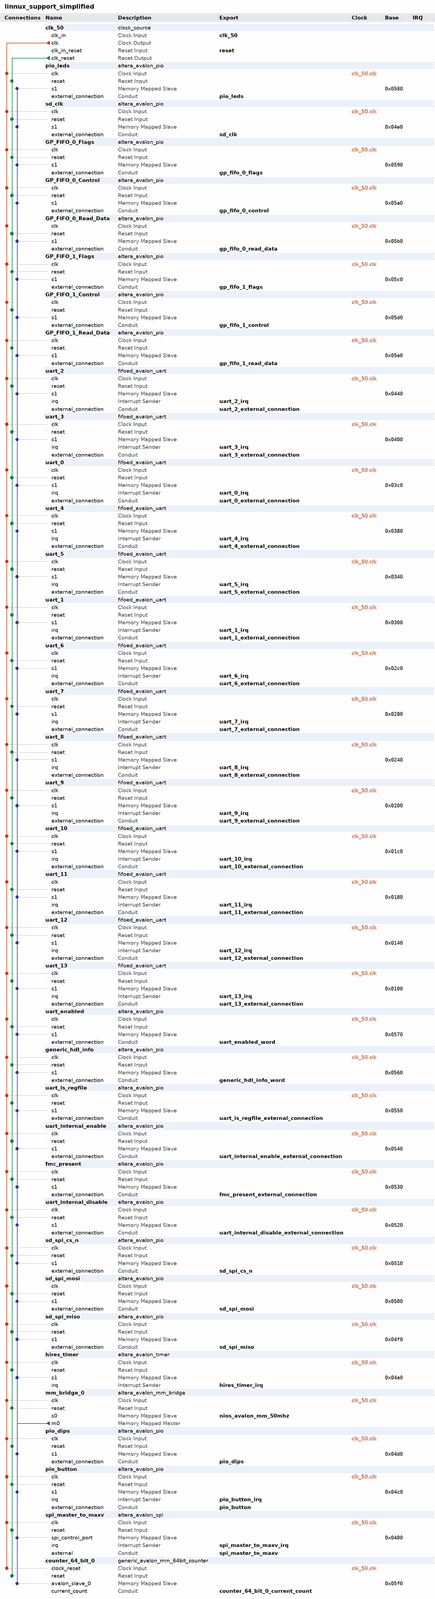
[diagram p0: system contents, whole]
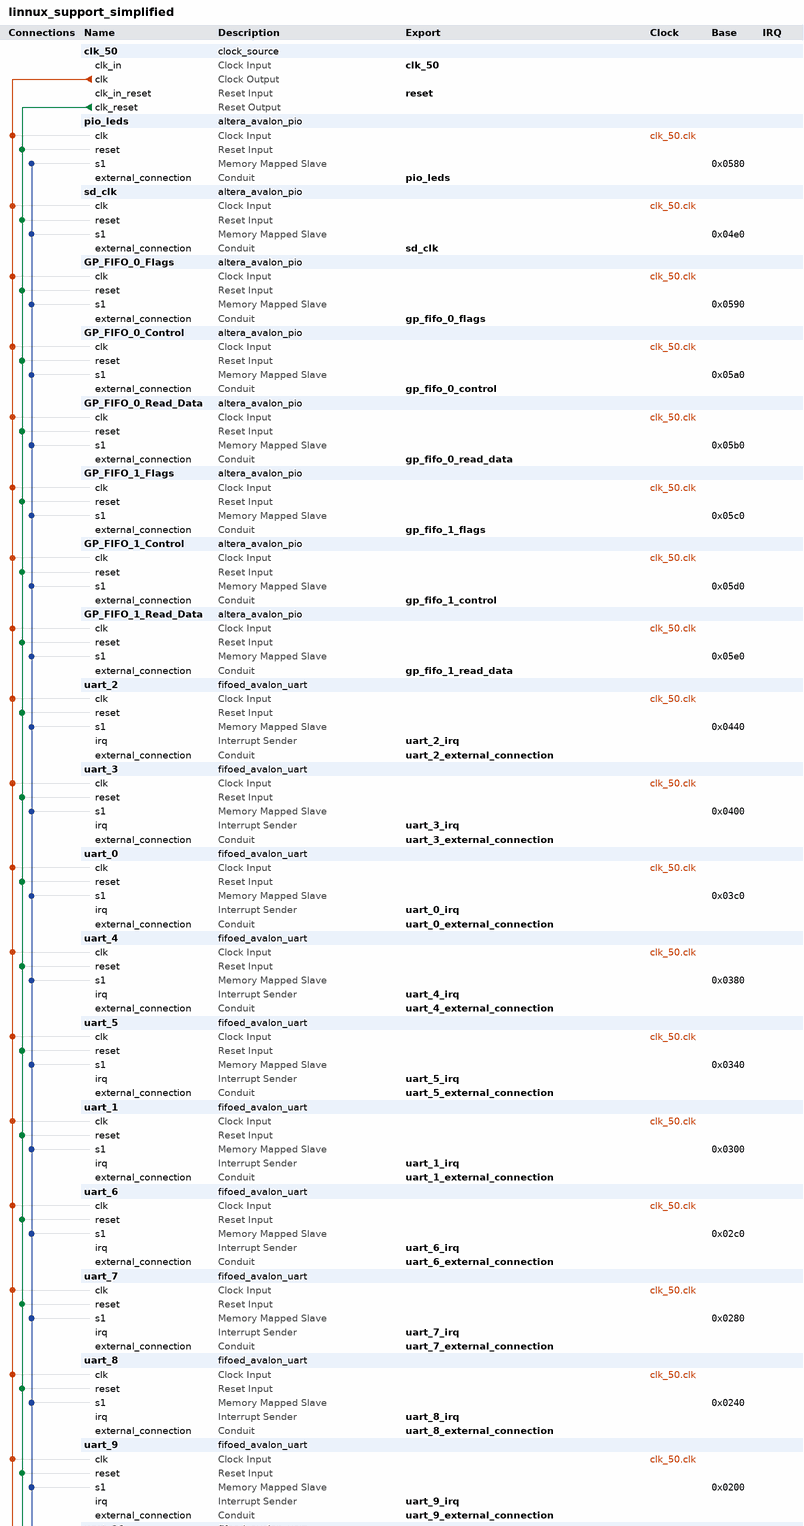
[diagram p1: system contents, upper part]
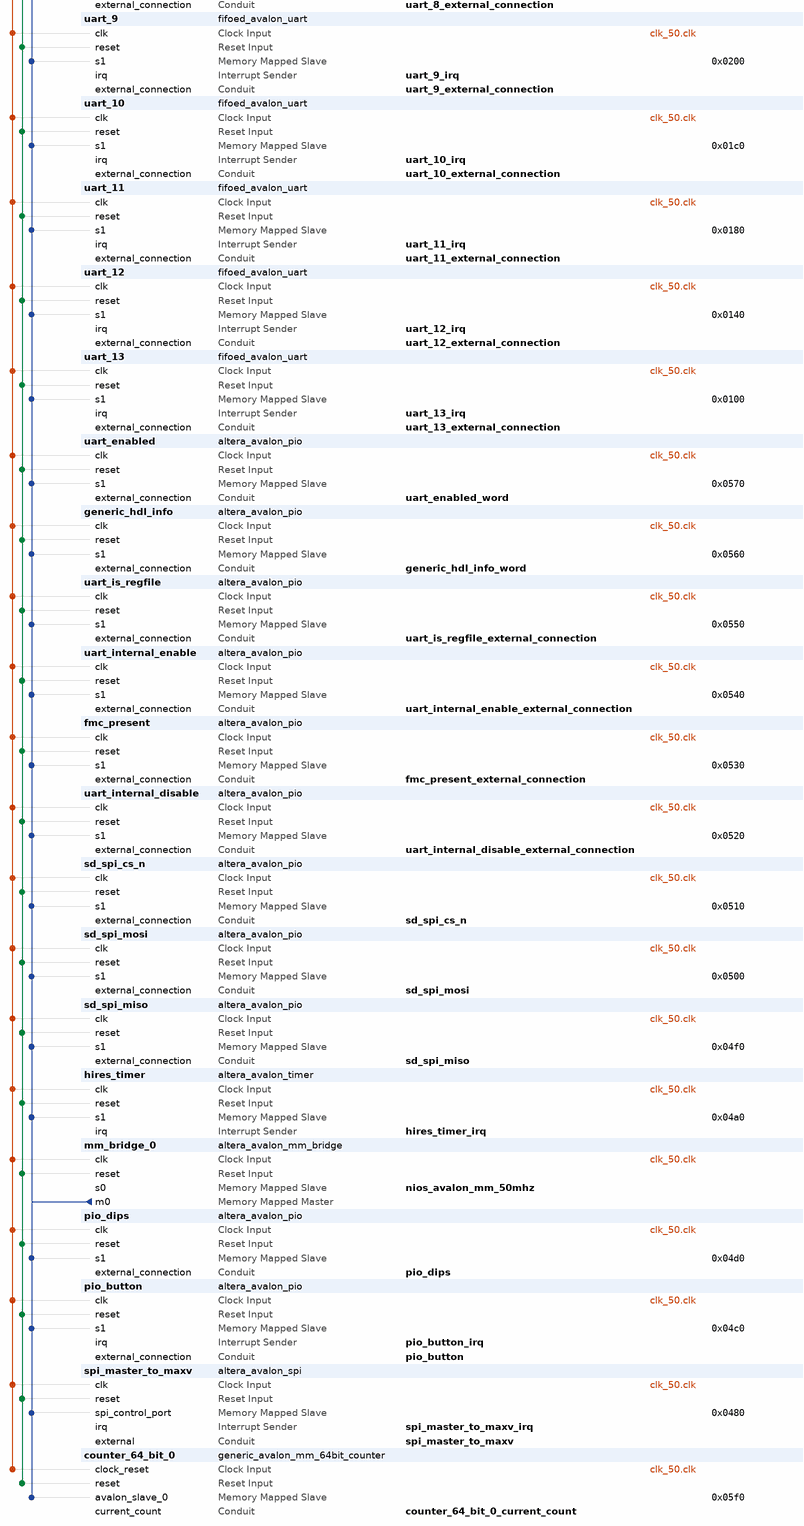
[diagram p2: system contents, lower part]
# Platform Designer (Qsys) system linnux_support_simplified, Stratix IV EP4SGX530KH40C2
# Parameters at their usual value, and those the tool derives, are not listed.
package require -exact qsys 14.1
create_system linnux_support_simplified
set_project_property DEVICE_FAMILY {Stratix IV}
set_project_property DEVICE EP4SGX530KH40C2

add_instance clk_50 clock_source 14.1
set_instance_parameter_value clk_50 clockFrequency 50000000

add_instance pio_leds altera_avalon_pio 14.1
set_instance_parameter_value pio_leds direction Output
set_instance_parameter_value pio_leds width 9

add_instance sd_clk altera_avalon_pio 14.1
set_instance_parameter_value sd_clk direction Output
set_instance_parameter_value sd_clk width 1

add_instance GP_FIFO_0_Flags altera_avalon_pio 14.1
set_instance_parameter_value GP_FIFO_0_Flags direction Input
set_instance_parameter_value GP_FIFO_0_Flags width 32

add_instance GP_FIFO_0_Control altera_avalon_pio 14.1
set_instance_parameter_value GP_FIFO_0_Control direction InOut
set_instance_parameter_value GP_FIFO_0_Control width 8

add_instance GP_FIFO_0_Read_Data altera_avalon_pio 14.1
set_instance_parameter_value GP_FIFO_0_Read_Data direction Input
set_instance_parameter_value GP_FIFO_0_Read_Data width 32

add_instance GP_FIFO_1_Flags altera_avalon_pio 14.1
set_instance_parameter_value GP_FIFO_1_Flags direction Input
set_instance_parameter_value GP_FIFO_1_Flags width 32

add_instance GP_FIFO_1_Control altera_avalon_pio 14.1
set_instance_parameter_value GP_FIFO_1_Control direction InOut
set_instance_parameter_value GP_FIFO_1_Control width 8

add_instance GP_FIFO_1_Read_Data altera_avalon_pio 14.1
set_instance_parameter_value GP_FIFO_1_Read_Data direction Input
set_instance_parameter_value GP_FIFO_1_Read_Data width 32

add_instance uart_2 fifoed_avalon_uart 13.1
set_instance_parameter_value uart_2 add_error_bits false
set_instance_parameter_value uart_2 baud 9600
set_instance_parameter_value uart_2 dataBits 8
set_instance_parameter_value uart_2 driver_pass_error_bits false
set_instance_parameter_value uart_2 export_handshake false
set_instance_parameter_value uart_2 fifo_export_used false
set_instance_parameter_value uart_2 fifo_size_rx 128
set_instance_parameter_value uart_2 fifo_size_tx 8
set_instance_parameter_value uart_2 fixedBaud true
set_instance_parameter_value uart_2 gap_value 4
set_instance_parameter_value uart_2 hw_cts false
set_instance_parameter_value uart_2 parity NONE
set_instance_parameter_value uart_2 rx_IRQ_Threshold 1
set_instance_parameter_value uart_2 rx_fifo_LE false
set_instance_parameter_value uart_2 simInteractiveInputEnable false
set_instance_parameter_value uart_2 simInteractiveOutputEnable false
set_instance_parameter_value uart_2 simTrueBaud false
set_instance_parameter_value uart_2 stopBits 1
set_instance_parameter_value uart_2 syncRegDepth 2
set_instance_parameter_value uart_2 timeout_value 20
set_instance_parameter_value uart_2 timestamp_width 8
set_instance_parameter_value uart_2 trans_pin false
set_instance_parameter_value uart_2 tx_IRQ_Threshold 1
set_instance_parameter_value uart_2 tx_fifo_LE false
set_instance_parameter_value uart_2 useCtsRts false
set_instance_parameter_value uart_2 useEopRegister false
set_instance_parameter_value uart_2 useRelativePathForSimFile false
set_instance_parameter_value uart_2 use_ext_timestamp false
set_instance_parameter_value uart_2 use_gap_detection false
set_instance_parameter_value uart_2 use_rx_fifo true
set_instance_parameter_value uart_2 use_status_bit_clear false
set_instance_parameter_value uart_2 use_timestamp false
set_instance_parameter_value uart_2 use_timout true
set_instance_parameter_value uart_2 use_tx_fifo false

add_instance uart_3 fifoed_avalon_uart 13.1
set_instance_parameter_value uart_3 add_error_bits false
set_instance_parameter_value uart_3 baud 9600
set_instance_parameter_value uart_3 dataBits 8
set_instance_parameter_value uart_3 driver_pass_error_bits false
set_instance_parameter_value uart_3 export_handshake false
set_instance_parameter_value uart_3 fifo_export_used false
set_instance_parameter_value uart_3 fifo_size_rx 128
set_instance_parameter_value uart_3 fifo_size_tx 8
set_instance_parameter_value uart_3 fixedBaud true
set_instance_parameter_value uart_3 gap_value 4
set_instance_parameter_value uart_3 hw_cts false
set_instance_parameter_value uart_3 parity NONE
set_instance_parameter_value uart_3 rx_IRQ_Threshold 1
set_instance_parameter_value uart_3 rx_fifo_LE false
set_instance_parameter_value uart_3 simInteractiveInputEnable false
set_instance_parameter_value uart_3 simInteractiveOutputEnable false
set_instance_parameter_value uart_3 simTrueBaud false
set_instance_parameter_value uart_3 stopBits 1
set_instance_parameter_value uart_3 syncRegDepth 2
set_instance_parameter_value uart_3 timeout_value 20
set_instance_parameter_value uart_3 timestamp_width 8
set_instance_parameter_value uart_3 trans_pin false
set_instance_parameter_value uart_3 tx_IRQ_Threshold 1
set_instance_parameter_value uart_3 tx_fifo_LE false
set_instance_parameter_value uart_3 useCtsRts false
set_instance_parameter_value uart_3 useEopRegister false
set_instance_parameter_value uart_3 useRelativePathForSimFile false
set_instance_parameter_value uart_3 use_ext_timestamp false
set_instance_parameter_value uart_3 use_gap_detection false
set_instance_parameter_value uart_3 use_rx_fifo true
set_instance_parameter_value uart_3 use_status_bit_clear false
set_instance_parameter_value uart_3 use_timestamp false
set_instance_parameter_value uart_3 use_timout true
set_instance_parameter_value uart_3 use_tx_fifo false

add_instance uart_0 fifoed_avalon_uart 13.1
set_instance_parameter_value uart_0 add_error_bits false
set_instance_parameter_value uart_0 baud 2000000
set_instance_parameter_value uart_0 dataBits 8
set_instance_parameter_value uart_0 driver_pass_error_bits false
set_instance_parameter_value uart_0 export_handshake false
set_instance_parameter_value uart_0 fifo_export_used false
set_instance_parameter_value uart_0 fifo_size_rx 128
set_instance_parameter_value uart_0 fifo_size_tx 128
set_instance_parameter_value uart_0 fixedBaud false
set_instance_parameter_value uart_0 gap_value 4
set_instance_parameter_value uart_0 hw_cts false
set_instance_parameter_value uart_0 parity NONE
set_instance_parameter_value uart_0 rx_IRQ_Threshold 1
set_instance_parameter_value uart_0 rx_fifo_LE false
set_instance_parameter_value uart_0 simInteractiveInputEnable false
set_instance_parameter_value uart_0 simInteractiveOutputEnable false
set_instance_parameter_value uart_0 simTrueBaud false
set_instance_parameter_value uart_0 stopBits 1
set_instance_parameter_value uart_0 syncRegDepth 2
set_instance_parameter_value uart_0 timeout_value 20
set_instance_parameter_value uart_0 timestamp_width 8
set_instance_parameter_value uart_0 trans_pin false
set_instance_parameter_value uart_0 tx_IRQ_Threshold 1
set_instance_parameter_value uart_0 tx_fifo_LE false
set_instance_parameter_value uart_0 useCtsRts false
set_instance_parameter_value uart_0 useEopRegister false
set_instance_parameter_value uart_0 useRelativePathForSimFile false
set_instance_parameter_value uart_0 use_ext_timestamp false
set_instance_parameter_value uart_0 use_gap_detection false
set_instance_parameter_value uart_0 use_rx_fifo true
set_instance_parameter_value uart_0 use_status_bit_clear false
set_instance_parameter_value uart_0 use_timestamp false
set_instance_parameter_value uart_0 use_timout true
set_instance_parameter_value uart_0 use_tx_fifo false

add_instance uart_4 fifoed_avalon_uart 13.1
set_instance_parameter_value uart_4 add_error_bits false
set_instance_parameter_value uart_4 baud 9600
set_instance_parameter_value uart_4 dataBits 8
set_instance_parameter_value uart_4 driver_pass_error_bits false
set_instance_parameter_value uart_4 export_handshake false
set_instance_parameter_value uart_4 fifo_export_used false
set_instance_parameter_value uart_4 fifo_size_rx 128
set_instance_parameter_value uart_4 fifo_size_tx 128
set_instance_parameter_value uart_4 fixedBaud true
set_instance_parameter_value uart_4 gap_value 4
set_instance_parameter_value uart_4 hw_cts false
set_instance_parameter_value uart_4 parity NONE
set_instance_parameter_value uart_4 rx_IRQ_Threshold 1
set_instance_parameter_value uart_4 rx_fifo_LE false
set_instance_parameter_value uart_4 simInteractiveInputEnable false
set_instance_parameter_value uart_4 simInteractiveOutputEnable false
set_instance_parameter_value uart_4 simTrueBaud false
set_instance_parameter_value uart_4 stopBits 1
set_instance_parameter_value uart_4 syncRegDepth 2
set_instance_parameter_value uart_4 timeout_value 20
set_instance_parameter_value uart_4 timestamp_width 8
set_instance_parameter_value uart_4 trans_pin false
set_instance_parameter_value uart_4 tx_IRQ_Threshold 1
set_instance_parameter_value uart_4 tx_fifo_LE false
set_instance_parameter_value uart_4 useCtsRts false
set_instance_parameter_value uart_4 useEopRegister false
set_instance_parameter_value uart_4 useRelativePathForSimFile false
set_instance_parameter_value uart_4 use_ext_timestamp false
set_instance_parameter_value uart_4 use_gap_detection false
set_instance_parameter_value uart_4 use_rx_fifo true
set_instance_parameter_value uart_4 use_status_bit_clear false
set_instance_parameter_value uart_4 use_timestamp false
set_instance_parameter_value uart_4 use_timout true
set_instance_parameter_value uart_4 use_tx_fifo false

add_instance uart_5 fifoed_avalon_uart 13.1
set_instance_parameter_value uart_5 add_error_bits false
set_instance_parameter_value uart_5 baud 2000000
set_instance_parameter_value uart_5 dataBits 8
set_instance_parameter_value uart_5 driver_pass_error_bits false
set_instance_parameter_value uart_5 export_handshake false
set_instance_parameter_value uart_5 fifo_export_used false
set_instance_parameter_value uart_5 fifo_size_rx 128
set_instance_parameter_value uart_5 fifo_size_tx 8
set_instance_parameter_value uart_5 fixedBaud true
set_instance_parameter_value uart_5 gap_value 4
set_instance_parameter_value uart_5 hw_cts false
set_instance_parameter_value uart_5 parity NONE
set_instance_parameter_value uart_5 rx_IRQ_Threshold 1
set_instance_parameter_value uart_5 rx_fifo_LE false
set_instance_parameter_value uart_5 simInteractiveInputEnable false
set_instance_parameter_value uart_5 simInteractiveOutputEnable false
set_instance_parameter_value uart_5 simTrueBaud false
set_instance_parameter_value uart_5 stopBits 1
set_instance_parameter_value uart_5 syncRegDepth 2
set_instance_parameter_value uart_5 timeout_value 20
set_instance_parameter_value uart_5 timestamp_width 8
set_instance_parameter_value uart_5 trans_pin false
set_instance_parameter_value uart_5 tx_IRQ_Threshold 1
set_instance_parameter_value uart_5 tx_fifo_LE false
set_instance_parameter_value uart_5 useCtsRts false
set_instance_parameter_value uart_5 useEopRegister false
set_instance_parameter_value uart_5 useRelativePathForSimFile false
set_instance_parameter_value uart_5 use_ext_timestamp false
set_instance_parameter_value uart_5 use_gap_detection false
set_instance_parameter_value uart_5 use_rx_fifo true
set_instance_parameter_value uart_5 use_status_bit_clear false
set_instance_parameter_value uart_5 use_timestamp false
set_instance_parameter_value uart_5 use_timout true
set_instance_parameter_value uart_5 use_tx_fifo false

add_instance uart_1 fifoed_avalon_uart 13.1
set_instance_parameter_value uart_1 add_error_bits false
set_instance_parameter_value uart_1 baud 9600
set_instance_parameter_value uart_1 dataBits 8
set_instance_parameter_value uart_1 driver_pass_error_bits false
set_instance_parameter_value uart_1 export_handshake false
set_instance_parameter_value uart_1 fifo_export_used false
set_instance_parameter_value uart_1 fifo_size_rx 128
set_instance_parameter_value uart_1 fifo_size_tx 8
set_instance_parameter_value uart_1 fixedBaud true
set_instance_parameter_value uart_1 gap_value 4
set_instance_parameter_value uart_1 hw_cts false
set_instance_parameter_value uart_1 parity NONE
set_instance_parameter_value uart_1 rx_IRQ_Threshold 1
set_instance_parameter_value uart_1 rx_fifo_LE false
set_instance_parameter_value uart_1 simInteractiveInputEnable false
set_instance_parameter_value uart_1 simInteractiveOutputEnable false
set_instance_parameter_value uart_1 simTrueBaud false
set_instance_parameter_value uart_1 stopBits 1
set_instance_parameter_value uart_1 syncRegDepth 2
set_instance_parameter_value uart_1 timeout_value 20
set_instance_parameter_value uart_1 timestamp_width 8
set_instance_parameter_value uart_1 trans_pin false
set_instance_parameter_value uart_1 tx_IRQ_Threshold 1
set_instance_parameter_value uart_1 tx_fifo_LE false
set_instance_parameter_value uart_1 useCtsRts false
set_instance_parameter_value uart_1 useEopRegister false
set_instance_parameter_value uart_1 useRelativePathForSimFile false
set_instance_parameter_value uart_1 use_ext_timestamp false
set_instance_parameter_value uart_1 use_gap_detection false
set_instance_parameter_value uart_1 use_rx_fifo true
set_instance_parameter_value uart_1 use_status_bit_clear false
set_instance_parameter_value uart_1 use_timestamp false
set_instance_parameter_value uart_1 use_timout true
set_instance_parameter_value uart_1 use_tx_fifo false

add_instance uart_6 fifoed_avalon_uart 13.1
set_instance_parameter_value uart_6 add_error_bits false
set_instance_parameter_value uart_6 baud 2000000
set_instance_parameter_value uart_6 dataBits 8
set_instance_parameter_value uart_6 driver_pass_error_bits false
set_instance_parameter_value uart_6 export_handshake false
set_instance_parameter_value uart_6 fifo_export_used false
set_instance_parameter_value uart_6 fifo_size_rx 128
set_instance_parameter_value uart_6 fifo_size_tx 8
set_instance_parameter_value uart_6 fixedBaud true
set_instance_parameter_value uart_6 gap_value 4
set_instance_parameter_value uart_6 hw_cts false
set_instance_parameter_value uart_6 parity NONE
set_instance_parameter_value uart_6 rx_IRQ_Threshold 1
set_instance_parameter_value uart_6 rx_fifo_LE false
set_instance_parameter_value uart_6 simInteractiveInputEnable false
set_instance_parameter_value uart_6 simInteractiveOutputEnable false
set_instance_parameter_value uart_6 simTrueBaud false
set_instance_parameter_value uart_6 stopBits 1
set_instance_parameter_value uart_6 syncRegDepth 2
set_instance_parameter_value uart_6 timeout_value 20
set_instance_parameter_value uart_6 timestamp_width 8
set_instance_parameter_value uart_6 trans_pin false
set_instance_parameter_value uart_6 tx_IRQ_Threshold 1
set_instance_parameter_value uart_6 tx_fifo_LE false
set_instance_parameter_value uart_6 useCtsRts false
set_instance_parameter_value uart_6 useEopRegister false
set_instance_parameter_value uart_6 useRelativePathForSimFile false
set_instance_parameter_value uart_6 use_ext_timestamp false
set_instance_parameter_value uart_6 use_gap_detection false
set_instance_parameter_value uart_6 use_rx_fifo true
set_instance_parameter_value uart_6 use_status_bit_clear false
set_instance_parameter_value uart_6 use_timestamp false
set_instance_parameter_value uart_6 use_timout true
set_instance_parameter_value uart_6 use_tx_fifo false

add_instance uart_7 fifoed_avalon_uart 13.1
set_instance_parameter_value uart_7 add_error_bits false
set_instance_parameter_value uart_7 baud 2000000
set_instance_parameter_value uart_7 dataBits 8
set_instance_parameter_value uart_7 driver_pass_error_bits false
set_instance_parameter_value uart_7 export_handshake false
set_instance_parameter_value uart_7 fifo_export_used false
set_instance_parameter_value uart_7 fifo_size_rx 128
set_instance_parameter_value uart_7 fifo_size_tx 8
set_instance_parameter_value uart_7 fixedBaud true
set_instance_parameter_value uart_7 gap_value 4
set_instance_parameter_value uart_7 hw_cts false
set_instance_parameter_value uart_7 parity NONE
set_instance_parameter_value uart_7 rx_IRQ_Threshold 1
set_instance_parameter_value uart_7 rx_fifo_LE false
set_instance_parameter_value uart_7 simInteractiveInputEnable false
set_instance_parameter_value uart_7 simInteractiveOutputEnable false
set_instance_parameter_value uart_7 simTrueBaud false
set_instance_parameter_value uart_7 stopBits 1
set_instance_parameter_value uart_7 syncRegDepth 2
set_instance_parameter_value uart_7 timeout_value 20
set_instance_parameter_value uart_7 timestamp_width 8
set_instance_parameter_value uart_7 trans_pin false
set_instance_parameter_value uart_7 tx_IRQ_Threshold 1
set_instance_parameter_value uart_7 tx_fifo_LE false
set_instance_parameter_value uart_7 useCtsRts false
set_instance_parameter_value uart_7 useEopRegister false
set_instance_parameter_value uart_7 useRelativePathForSimFile false
set_instance_parameter_value uart_7 use_ext_timestamp false
set_instance_parameter_value uart_7 use_gap_detection false
set_instance_parameter_value uart_7 use_rx_fifo true
set_instance_parameter_value uart_7 use_status_bit_clear false
set_instance_parameter_value uart_7 use_timestamp false
set_instance_parameter_value uart_7 use_timout true
set_instance_parameter_value uart_7 use_tx_fifo false

add_instance uart_8 fifoed_avalon_uart 13.1
set_instance_parameter_value uart_8 add_error_bits false
set_instance_parameter_value uart_8 baud 2000000
set_instance_parameter_value uart_8 dataBits 8
set_instance_parameter_value uart_8 driver_pass_error_bits false
set_instance_parameter_value uart_8 export_handshake false
set_instance_parameter_value uart_8 fifo_export_used false
set_instance_parameter_value uart_8 fifo_size_rx 128
set_instance_parameter_value uart_8 fifo_size_tx 8
set_instance_parameter_value uart_8 fixedBaud true
set_instance_parameter_value uart_8 gap_value 4
set_instance_parameter_value uart_8 hw_cts false
set_instance_parameter_value uart_8 parity NONE
set_instance_parameter_value uart_8 rx_IRQ_Threshold 1
set_instance_parameter_value uart_8 rx_fifo_LE false
set_instance_parameter_value uart_8 simInteractiveInputEnable false
set_instance_parameter_value uart_8 simInteractiveOutputEnable false
set_instance_parameter_value uart_8 simTrueBaud false
set_instance_parameter_value uart_8 stopBits 1
set_instance_parameter_value uart_8 syncRegDepth 2
set_instance_parameter_value uart_8 timeout_value 20
set_instance_parameter_value uart_8 timestamp_width 8
set_instance_parameter_value uart_8 trans_pin false
set_instance_parameter_value uart_8 tx_IRQ_Threshold 1
set_instance_parameter_value uart_8 tx_fifo_LE false
set_instance_parameter_value uart_8 useCtsRts false
set_instance_parameter_value uart_8 useEopRegister false
set_instance_parameter_value uart_8 useRelativePathForSimFile false
set_instance_parameter_value uart_8 use_ext_timestamp false
set_instance_parameter_value uart_8 use_gap_detection false
set_instance_parameter_value uart_8 use_rx_fifo true
set_instance_parameter_value uart_8 use_status_bit_clear false
set_instance_parameter_value uart_8 use_timestamp false
set_instance_parameter_value uart_8 use_timout true
set_instance_parameter_value uart_8 use_tx_fifo false

add_instance uart_9 fifoed_avalon_uart 13.1
set_instance_parameter_value uart_9 add_error_bits false
set_instance_parameter_value uart_9 baud 2000000
set_instance_parameter_value uart_9 dataBits 8
set_instance_parameter_value uart_9 driver_pass_error_bits false
set_instance_parameter_value uart_9 export_handshake false
set_instance_parameter_value uart_9 fifo_export_used false
set_instance_parameter_value uart_9 fifo_size_rx 128
set_instance_parameter_value uart_9 fifo_size_tx 8
set_instance_parameter_value uart_9 fixedBaud true
set_instance_parameter_value uart_9 gap_value 4
set_instance_parameter_value uart_9 hw_cts false
set_instance_parameter_value uart_9 parity NONE
set_instance_parameter_value uart_9 rx_IRQ_Threshold 1
set_instance_parameter_value uart_9 rx_fifo_LE false
set_instance_parameter_value uart_9 simInteractiveInputEnable false
set_instance_parameter_value uart_9 simInteractiveOutputEnable false
set_instance_parameter_value uart_9 simTrueBaud false
set_instance_parameter_value uart_9 stopBits 1
set_instance_parameter_value uart_9 syncRegDepth 2
set_instance_parameter_value uart_9 timeout_value 20
set_instance_parameter_value uart_9 timestamp_width 8
set_instance_parameter_value uart_9 trans_pin false
set_instance_parameter_value uart_9 tx_IRQ_Threshold 1
set_instance_parameter_value uart_9 tx_fifo_LE false
set_instance_parameter_value uart_9 useCtsRts false
set_instance_parameter_value uart_9 useEopRegister false
set_instance_parameter_value uart_9 useRelativePathForSimFile false
set_instance_parameter_value uart_9 use_ext_timestamp false
set_instance_parameter_value uart_9 use_gap_detection false
set_instance_parameter_value uart_9 use_rx_fifo true
set_instance_parameter_value uart_9 use_status_bit_clear false
set_instance_parameter_value uart_9 use_timestamp false
set_instance_parameter_value uart_9 use_timout true
set_instance_parameter_value uart_9 use_tx_fifo false

add_instance uart_10 fifoed_avalon_uart 13.1
set_instance_parameter_value uart_10 add_error_bits false
set_instance_parameter_value uart_10 baud 2000000
set_instance_parameter_value uart_10 dataBits 8
set_instance_parameter_value uart_10 driver_pass_error_bits false
set_instance_parameter_value uart_10 export_handshake false
set_instance_parameter_value uart_10 fifo_export_used false
set_instance_parameter_value uart_10 fifo_size_rx 128
set_instance_parameter_value uart_10 fifo_size_tx 8
set_instance_parameter_value uart_10 fixedBaud true
set_instance_parameter_value uart_10 gap_value 4
set_instance_parameter_value uart_10 hw_cts false
set_instance_parameter_value uart_10 parity NONE
set_instance_parameter_value uart_10 rx_IRQ_Threshold 1
set_instance_parameter_value uart_10 rx_fifo_LE false
set_instance_parameter_value uart_10 simInteractiveInputEnable false
set_instance_parameter_value uart_10 simInteractiveOutputEnable false
set_instance_parameter_value uart_10 simTrueBaud false
set_instance_parameter_value uart_10 stopBits 1
set_instance_parameter_value uart_10 syncRegDepth 2
set_instance_parameter_value uart_10 timeout_value 20
set_instance_parameter_value uart_10 timestamp_width 8
set_instance_parameter_value uart_10 trans_pin false
set_instance_parameter_value uart_10 tx_IRQ_Threshold 1
set_instance_parameter_value uart_10 tx_fifo_LE false
set_instance_parameter_value uart_10 useCtsRts false
set_instance_parameter_value uart_10 useEopRegister false
set_instance_parameter_value uart_10 useRelativePathForSimFile false
set_instance_parameter_value uart_10 use_ext_timestamp false
set_instance_parameter_value uart_10 use_gap_detection false
set_instance_parameter_value uart_10 use_rx_fifo true
set_instance_parameter_value uart_10 use_status_bit_clear false
set_instance_parameter_value uart_10 use_timestamp false
set_instance_parameter_value uart_10 use_timout true
set_instance_parameter_value uart_10 use_tx_fifo false

add_instance uart_11 fifoed_avalon_uart 13.1
set_instance_parameter_value uart_11 add_error_bits false
set_instance_parameter_value uart_11 baud 2000000
set_instance_parameter_value uart_11 dataBits 8
set_instance_parameter_value uart_11 driver_pass_error_bits false
set_instance_parameter_value uart_11 export_handshake false
set_instance_parameter_value uart_11 fifo_export_used false
set_instance_parameter_value uart_11 fifo_size_rx 128
set_instance_parameter_value uart_11 fifo_size_tx 8
set_instance_parameter_value uart_11 fixedBaud true
set_instance_parameter_value uart_11 gap_value 4
set_instance_parameter_value uart_11 hw_cts false
set_instance_parameter_value uart_11 parity NONE
set_instance_parameter_value uart_11 rx_IRQ_Threshold 1
set_instance_parameter_value uart_11 rx_fifo_LE false
set_instance_parameter_value uart_11 simInteractiveInputEnable false
set_instance_parameter_value uart_11 simInteractiveOutputEnable false
set_instance_parameter_value uart_11 simTrueBaud false
set_instance_parameter_value uart_11 stopBits 1
set_instance_parameter_value uart_11 syncRegDepth 2
set_instance_parameter_value uart_11 timeout_value 20
set_instance_parameter_value uart_11 timestamp_width 8
set_instance_parameter_value uart_11 trans_pin false
set_instance_parameter_value uart_11 tx_IRQ_Threshold 1
set_instance_parameter_value uart_11 tx_fifo_LE false
set_instance_parameter_value uart_11 useCtsRts false
set_instance_parameter_value uart_11 useEopRegister false
set_instance_parameter_value uart_11 useRelativePathForSimFile false
set_instance_parameter_value uart_11 use_ext_timestamp false
set_instance_parameter_value uart_11 use_gap_detection false
set_instance_parameter_value uart_11 use_rx_fifo true
set_instance_parameter_value uart_11 use_status_bit_clear false
set_instance_parameter_value uart_11 use_timestamp false
set_instance_parameter_value uart_11 use_timout true
set_instance_parameter_value uart_11 use_tx_fifo false

add_instance uart_12 fifoed_avalon_uart 13.1
set_instance_parameter_value uart_12 add_error_bits false
set_instance_parameter_value uart_12 baud 2000000
set_instance_parameter_value uart_12 dataBits 8
set_instance_parameter_value uart_12 driver_pass_error_bits false
set_instance_parameter_value uart_12 export_handshake false
set_instance_parameter_value uart_12 fifo_export_used false
set_instance_parameter_value uart_12 fifo_size_rx 128
set_instance_parameter_value uart_12 fifo_size_tx 8
set_instance_parameter_value uart_12 fixedBaud true
set_instance_parameter_value uart_12 gap_value 4
set_instance_parameter_value uart_12 hw_cts false
set_instance_parameter_value uart_12 parity NONE
set_instance_parameter_value uart_12 rx_IRQ_Threshold 1
set_instance_parameter_value uart_12 rx_fifo_LE false
set_instance_parameter_value uart_12 simInteractiveInputEnable false
set_instance_parameter_value uart_12 simInteractiveOutputEnable false
set_instance_parameter_value uart_12 simTrueBaud false
set_instance_parameter_value uart_12 stopBits 1
set_instance_parameter_value uart_12 syncRegDepth 2
set_instance_parameter_value uart_12 timeout_value 20
set_instance_parameter_value uart_12 timestamp_width 8
set_instance_parameter_value uart_12 trans_pin false
set_instance_parameter_value uart_12 tx_IRQ_Threshold 1
set_instance_parameter_value uart_12 tx_fifo_LE false
set_instance_parameter_value uart_12 useCtsRts false
set_instance_parameter_value uart_12 useEopRegister false
set_instance_parameter_value uart_12 useRelativePathForSimFile false
set_instance_parameter_value uart_12 use_ext_timestamp false
set_instance_parameter_value uart_12 use_gap_detection false
set_instance_parameter_value uart_12 use_rx_fifo true
set_instance_parameter_value uart_12 use_status_bit_clear false
set_instance_parameter_value uart_12 use_timestamp false
set_instance_parameter_value uart_12 use_timout true
set_instance_parameter_value uart_12 use_tx_fifo false

add_instance uart_13 fifoed_avalon_uart 13.1
set_instance_parameter_value uart_13 add_error_bits false
set_instance_parameter_value uart_13 baud 2000000
set_instance_parameter_value uart_13 dataBits 8
set_instance_parameter_value uart_13 driver_pass_error_bits false
set_instance_parameter_value uart_13 export_handshake false
set_instance_parameter_value uart_13 fifo_export_used false
set_instance_parameter_value uart_13 fifo_size_rx 128
set_instance_parameter_value uart_13 fifo_size_tx 8
set_instance_parameter_value uart_13 fixedBaud true
set_instance_parameter_value uart_13 gap_value 4
set_instance_parameter_value uart_13 hw_cts false
set_instance_parameter_value uart_13 parity NONE
set_instance_parameter_value uart_13 rx_IRQ_Threshold 1
set_instance_parameter_value uart_13 rx_fifo_LE false
set_instance_parameter_value uart_13 simInteractiveInputEnable false
set_instance_parameter_value uart_13 simInteractiveOutputEnable false
set_instance_parameter_value uart_13 simTrueBaud false
set_instance_parameter_value uart_13 stopBits 1
set_instance_parameter_value uart_13 syncRegDepth 2
set_instance_parameter_value uart_13 timeout_value 20
set_instance_parameter_value uart_13 timestamp_width 8
set_instance_parameter_value uart_13 trans_pin false
set_instance_parameter_value uart_13 tx_IRQ_Threshold 1
set_instance_parameter_value uart_13 tx_fifo_LE false
set_instance_parameter_value uart_13 useCtsRts false
set_instance_parameter_value uart_13 useEopRegister false
set_instance_parameter_value uart_13 useRelativePathForSimFile false
set_instance_parameter_value uart_13 use_ext_timestamp false
set_instance_parameter_value uart_13 use_gap_detection false
set_instance_parameter_value uart_13 use_rx_fifo true
set_instance_parameter_value uart_13 use_status_bit_clear false
set_instance_parameter_value uart_13 use_timestamp false
set_instance_parameter_value uart_13 use_timout true
set_instance_parameter_value uart_13 use_tx_fifo false

add_instance uart_enabled altera_avalon_pio 14.1
set_instance_parameter_value uart_enabled direction Input
set_instance_parameter_value uart_enabled width 32

add_instance generic_hdl_info altera_avalon_pio 14.1
set_instance_parameter_value generic_hdl_info direction Input
set_instance_parameter_value generic_hdl_info width 32

add_instance uart_is_regfile altera_avalon_pio 14.1
set_instance_parameter_value uart_is_regfile direction Input
set_instance_parameter_value uart_is_regfile width 32

add_instance uart_internal_enable altera_avalon_pio 14.1
set_instance_parameter_value uart_internal_enable direction Output
set_instance_parameter_value uart_internal_enable width 32

add_instance fmc_present altera_avalon_pio 14.1
set_instance_parameter_value fmc_present direction Input
set_instance_parameter_value fmc_present width 16

add_instance uart_internal_disable altera_avalon_pio 14.1
set_instance_parameter_value uart_internal_disable direction Output
set_instance_parameter_value uart_internal_disable width 32

add_instance sd_spi_cs_n altera_avalon_pio 14.1
set_instance_parameter_value sd_spi_cs_n direction Output
set_instance_parameter_value sd_spi_cs_n resetValue 1
set_instance_parameter_value sd_spi_cs_n width 1

add_instance sd_spi_mosi altera_avalon_pio 14.1
set_instance_parameter_value sd_spi_mosi direction Output
set_instance_parameter_value sd_spi_mosi resetValue 1
set_instance_parameter_value sd_spi_mosi width 1

add_instance sd_spi_miso altera_avalon_pio 14.1
set_instance_parameter_value sd_spi_miso direction Input
set_instance_parameter_value sd_spi_miso width 1

add_instance hires_timer altera_avalon_timer 14.1
set_instance_parameter_value hires_timer period 1
set_instance_parameter_value hires_timer periodUnits MSEC

add_instance mm_bridge_0 altera_avalon_mm_bridge 14.1
set_instance_parameter_value mm_bridge_0 ADDRESS_UNITS SYMBOLS
set_instance_parameter_value mm_bridge_0 ADDRESS_WIDTH 27
set_instance_parameter_value mm_bridge_0 DATA_WIDTH 32
set_instance_parameter_value mm_bridge_0 MAX_PENDING_RESPONSES 4
set_instance_parameter_value mm_bridge_0 USE_AUTO_ADDRESS_WIDTH 0

add_instance pio_dips altera_avalon_pio 14.1
set_instance_parameter_value pio_dips direction Input
set_instance_parameter_value pio_dips width 8

add_instance pio_button altera_avalon_pio 14.1
set_instance_parameter_value pio_button captureEdge true
set_instance_parameter_value pio_button direction Input
set_instance_parameter_value pio_button generateIRQ true
set_instance_parameter_value pio_button irqType EDGE
set_instance_parameter_value pio_button width 8

add_instance spi_master_to_maxv altera_avalon_spi 14.1
set_instance_parameter_value spi_master_to_maxv clockPhase 1
set_instance_parameter_value spi_master_to_maxv clockPolarity 0
set_instance_parameter_value spi_master_to_maxv dataWidth 8
set_instance_parameter_value spi_master_to_maxv insertSync true
set_instance_parameter_value spi_master_to_maxv masterSPI true
set_instance_parameter_value spi_master_to_maxv numberOfSlaves 1
set_instance_parameter_value spi_master_to_maxv syncRegDepth 3
set_instance_parameter_value spi_master_to_maxv targetClockRate 32000

add_instance counter_64_bit_0 generic_avalon_mm_64bit_counter 2.0

# connections
add_connection clk_50.clk counter_64_bit_0.clock_reset clock
add_connection clk_50.clk fmc_present.clk clock
add_connection clk_50.clk generic_hdl_info.clk clock
add_connection clk_50.clk GP_FIFO_0_Control.clk clock
add_connection clk_50.clk GP_FIFO_0_Flags.clk clock
add_connection clk_50.clk GP_FIFO_0_Read_Data.clk clock
add_connection clk_50.clk GP_FIFO_1_Control.clk clock
add_connection clk_50.clk GP_FIFO_1_Flags.clk clock
add_connection clk_50.clk GP_FIFO_1_Read_Data.clk clock
add_connection clk_50.clk hires_timer.clk clock
add_connection clk_50.clk mm_bridge_0.clk clock
add_connection clk_50.clk pio_button.clk clock
add_connection clk_50.clk pio_dips.clk clock
add_connection clk_50.clk pio_leds.clk clock
add_connection clk_50.clk sd_clk.clk clock
add_connection clk_50.clk sd_spi_cs_n.clk clock
add_connection clk_50.clk sd_spi_miso.clk clock
add_connection clk_50.clk sd_spi_mosi.clk clock
add_connection clk_50.clk spi_master_to_maxv.clk clock
add_connection clk_50.clk uart_0.clk clock
add_connection clk_50.clk uart_1.clk clock
add_connection clk_50.clk uart_2.clk clock
add_connection clk_50.clk uart_3.clk clock
add_connection clk_50.clk uart_4.clk clock
add_connection clk_50.clk uart_5.clk clock
add_connection clk_50.clk uart_6.clk clock
add_connection clk_50.clk uart_7.clk clock
add_connection clk_50.clk uart_8.clk clock
add_connection clk_50.clk uart_9.clk clock
add_connection clk_50.clk uart_10.clk clock
add_connection clk_50.clk uart_11.clk clock
add_connection clk_50.clk uart_12.clk clock
add_connection clk_50.clk uart_13.clk clock
add_connection clk_50.clk uart_enabled.clk clock
add_connection clk_50.clk uart_internal_disable.clk clock
add_connection clk_50.clk uart_internal_enable.clk clock
add_connection clk_50.clk uart_is_regfile.clk clock
add_connection clk_50.clk_reset counter_64_bit_0.reset reset
add_connection clk_50.clk_reset fmc_present.reset reset
add_connection clk_50.clk_reset generic_hdl_info.reset reset
add_connection clk_50.clk_reset GP_FIFO_0_Control.reset reset
add_connection clk_50.clk_reset GP_FIFO_0_Flags.reset reset
add_connection clk_50.clk_reset GP_FIFO_0_Read_Data.reset reset
add_connection clk_50.clk_reset GP_FIFO_1_Control.reset reset
add_connection clk_50.clk_reset GP_FIFO_1_Flags.reset reset
add_connection clk_50.clk_reset GP_FIFO_1_Read_Data.reset reset
add_connection clk_50.clk_reset hires_timer.reset reset
add_connection clk_50.clk_reset mm_bridge_0.reset reset
add_connection clk_50.clk_reset pio_button.reset reset
add_connection clk_50.clk_reset pio_dips.reset reset
add_connection clk_50.clk_reset pio_leds.reset reset
add_connection clk_50.clk_reset sd_clk.reset reset
add_connection clk_50.clk_reset sd_spi_cs_n.reset reset
add_connection clk_50.clk_reset sd_spi_miso.reset reset
add_connection clk_50.clk_reset sd_spi_mosi.reset reset
add_connection clk_50.clk_reset spi_master_to_maxv.reset reset
add_connection clk_50.clk_reset uart_0.reset reset
add_connection clk_50.clk_reset uart_1.reset reset
add_connection clk_50.clk_reset uart_2.reset reset
add_connection clk_50.clk_reset uart_3.reset reset
add_connection clk_50.clk_reset uart_4.reset reset
add_connection clk_50.clk_reset uart_5.reset reset
add_connection clk_50.clk_reset uart_6.reset reset
add_connection clk_50.clk_reset uart_7.reset reset
add_connection clk_50.clk_reset uart_8.reset reset
add_connection clk_50.clk_reset uart_9.reset reset
add_connection clk_50.clk_reset uart_10.reset reset
add_connection clk_50.clk_reset uart_11.reset reset
add_connection clk_50.clk_reset uart_12.reset reset
add_connection clk_50.clk_reset uart_13.reset reset
add_connection clk_50.clk_reset uart_enabled.reset reset
add_connection clk_50.clk_reset uart_internal_disable.reset reset
add_connection clk_50.clk_reset uart_internal_enable.reset reset
add_connection clk_50.clk_reset uart_is_regfile.reset reset
add_connection mm_bridge_0.m0 counter_64_bit_0.avalon_slave_0 avalon
set_connection_parameter_value mm_bridge_0.m0/counter_64_bit_0.avalon_slave_0 baseAddress 0x05f0
add_connection mm_bridge_0.m0 fmc_present.s1 avalon
set_connection_parameter_value mm_bridge_0.m0/fmc_present.s1 baseAddress 0x0530
add_connection mm_bridge_0.m0 generic_hdl_info.s1 avalon
set_connection_parameter_value mm_bridge_0.m0/generic_hdl_info.s1 baseAddress 0x0560
add_connection mm_bridge_0.m0 GP_FIFO_0_Control.s1 avalon
set_connection_parameter_value mm_bridge_0.m0/GP_FIFO_0_Control.s1 baseAddress 0x05a0
add_connection mm_bridge_0.m0 GP_FIFO_0_Flags.s1 avalon
set_connection_parameter_value mm_bridge_0.m0/GP_FIFO_0_Flags.s1 baseAddress 0x0590
add_connection mm_bridge_0.m0 GP_FIFO_0_Read_Data.s1 avalon
set_connection_parameter_value mm_bridge_0.m0/GP_FIFO_0_Read_Data.s1 baseAddress 0x05b0
add_connection mm_bridge_0.m0 GP_FIFO_1_Control.s1 avalon
set_connection_parameter_value mm_bridge_0.m0/GP_FIFO_1_Control.s1 baseAddress 0x05d0
add_connection mm_bridge_0.m0 GP_FIFO_1_Flags.s1 avalon
set_connection_parameter_value mm_bridge_0.m0/GP_FIFO_1_Flags.s1 baseAddress 0x05c0
add_connection mm_bridge_0.m0 GP_FIFO_1_Read_Data.s1 avalon
set_connection_parameter_value mm_bridge_0.m0/GP_FIFO_1_Read_Data.s1 baseAddress 0x05e0
add_connection mm_bridge_0.m0 hires_timer.s1 avalon
set_connection_parameter_value mm_bridge_0.m0/hires_timer.s1 baseAddress 0x04a0
add_connection mm_bridge_0.m0 pio_button.s1 avalon
set_connection_parameter_value mm_bridge_0.m0/pio_button.s1 baseAddress 0x04c0
add_connection mm_bridge_0.m0 pio_dips.s1 avalon
set_connection_parameter_value mm_bridge_0.m0/pio_dips.s1 baseAddress 0x04d0
add_connection mm_bridge_0.m0 pio_leds.s1 avalon
set_connection_parameter_value mm_bridge_0.m0/pio_leds.s1 baseAddress 0x0580
add_connection mm_bridge_0.m0 sd_clk.s1 avalon
set_connection_parameter_value mm_bridge_0.m0/sd_clk.s1 baseAddress 0x04e0
add_connection mm_bridge_0.m0 sd_spi_cs_n.s1 avalon
set_connection_parameter_value mm_bridge_0.m0/sd_spi_cs_n.s1 baseAddress 0x0510
add_connection mm_bridge_0.m0 sd_spi_miso.s1 avalon
set_connection_parameter_value mm_bridge_0.m0/sd_spi_miso.s1 baseAddress 0x04f0
add_connection mm_bridge_0.m0 sd_spi_mosi.s1 avalon
set_connection_parameter_value mm_bridge_0.m0/sd_spi_mosi.s1 baseAddress 0x0500
add_connection mm_bridge_0.m0 spi_master_to_maxv.spi_control_port avalon
set_connection_parameter_value mm_bridge_0.m0/spi_master_to_maxv.spi_control_port baseAddress 0x0480
add_connection mm_bridge_0.m0 uart_0.s1 avalon
set_connection_parameter_value mm_bridge_0.m0/uart_0.s1 baseAddress 0x03c0
add_connection mm_bridge_0.m0 uart_1.s1 avalon
set_connection_parameter_value mm_bridge_0.m0/uart_1.s1 baseAddress 0x0300
add_connection mm_bridge_0.m0 uart_2.s1 avalon
set_connection_parameter_value mm_bridge_0.m0/uart_2.s1 baseAddress 0x0440
add_connection mm_bridge_0.m0 uart_3.s1 avalon
set_connection_parameter_value mm_bridge_0.m0/uart_3.s1 baseAddress 0x0400
add_connection mm_bridge_0.m0 uart_4.s1 avalon
set_connection_parameter_value mm_bridge_0.m0/uart_4.s1 baseAddress 0x0380
add_connection mm_bridge_0.m0 uart_5.s1 avalon
set_connection_parameter_value mm_bridge_0.m0/uart_5.s1 baseAddress 0x0340
add_connection mm_bridge_0.m0 uart_6.s1 avalon
set_connection_parameter_value mm_bridge_0.m0/uart_6.s1 baseAddress 0x02c0
add_connection mm_bridge_0.m0 uart_7.s1 avalon
set_connection_parameter_value mm_bridge_0.m0/uart_7.s1 baseAddress 0x0280
add_connection mm_bridge_0.m0 uart_8.s1 avalon
set_connection_parameter_value mm_bridge_0.m0/uart_8.s1 baseAddress 0x0240
add_connection mm_bridge_0.m0 uart_9.s1 avalon
set_connection_parameter_value mm_bridge_0.m0/uart_9.s1 baseAddress 0x0200
add_connection mm_bridge_0.m0 uart_10.s1 avalon
set_connection_parameter_value mm_bridge_0.m0/uart_10.s1 baseAddress 0x01c0
add_connection mm_bridge_0.m0 uart_11.s1 avalon
set_connection_parameter_value mm_bridge_0.m0/uart_11.s1 baseAddress 0x0180
add_connection mm_bridge_0.m0 uart_12.s1 avalon
set_connection_parameter_value mm_bridge_0.m0/uart_12.s1 baseAddress 0x0140
add_connection mm_bridge_0.m0 uart_13.s1 avalon
set_connection_parameter_value mm_bridge_0.m0/uart_13.s1 baseAddress 0x0100
add_connection mm_bridge_0.m0 uart_enabled.s1 avalon
set_connection_parameter_value mm_bridge_0.m0/uart_enabled.s1 baseAddress 0x0570
add_connection mm_bridge_0.m0 uart_internal_disable.s1 avalon
set_connection_parameter_value mm_bridge_0.m0/uart_internal_disable.s1 baseAddress 0x0520
add_connection mm_bridge_0.m0 uart_internal_enable.s1 avalon
set_connection_parameter_value mm_bridge_0.m0/uart_internal_enable.s1 baseAddress 0x0540
add_connection mm_bridge_0.m0 uart_is_regfile.s1 avalon
set_connection_parameter_value mm_bridge_0.m0/uart_is_regfile.s1 baseAddress 0x0550

# exported interfaces
add_interface clk_50 clock sink
set_interface_property clk_50 EXPORT_OF clk_50.clk_in
add_interface counter_64_bit_0_current_count conduit end
set_interface_property counter_64_bit_0_current_count EXPORT_OF counter_64_bit_0.current_count
add_interface fmc_present_external_connection conduit end
set_interface_property fmc_present_external_connection EXPORT_OF fmc_present.external_connection
add_interface generic_hdl_info_word conduit end
set_interface_property generic_hdl_info_word EXPORT_OF generic_hdl_info.external_connection
add_interface gp_fifo_0_control conduit end
set_interface_property gp_fifo_0_control EXPORT_OF GP_FIFO_0_Control.external_connection
add_interface gp_fifo_0_flags conduit end
set_interface_property gp_fifo_0_flags EXPORT_OF GP_FIFO_0_Flags.external_connection
add_interface gp_fifo_0_read_data conduit end
set_interface_property gp_fifo_0_read_data EXPORT_OF GP_FIFO_0_Read_Data.external_connection
add_interface gp_fifo_1_control conduit end
set_interface_property gp_fifo_1_control EXPORT_OF GP_FIFO_1_Control.external_connection
add_interface gp_fifo_1_flags conduit end
set_interface_property gp_fifo_1_flags EXPORT_OF GP_FIFO_1_Flags.external_connection
add_interface gp_fifo_1_read_data conduit end
set_interface_property gp_fifo_1_read_data EXPORT_OF GP_FIFO_1_Read_Data.external_connection
add_interface hires_timer_irq interrupt sender
set_interface_property hires_timer_irq EXPORT_OF hires_timer.irq
add_interface nios_avalon_mm_50mhz avalon slave
set_interface_property nios_avalon_mm_50mhz EXPORT_OF mm_bridge_0.s0
add_interface pio_button conduit end
set_interface_property pio_button EXPORT_OF pio_button.external_connection
add_interface pio_button_irq interrupt sender
set_interface_property pio_button_irq EXPORT_OF pio_button.irq
add_interface pio_dips conduit end
set_interface_property pio_dips EXPORT_OF pio_dips.external_connection
add_interface pio_leds conduit end
set_interface_property pio_leds EXPORT_OF pio_leds.external_connection
add_interface reset reset sink
set_interface_property reset EXPORT_OF clk_50.clk_in_reset
add_interface sd_clk conduit end
set_interface_property sd_clk EXPORT_OF sd_clk.external_connection
add_interface sd_spi_cs_n conduit end
set_interface_property sd_spi_cs_n EXPORT_OF sd_spi_cs_n.external_connection
add_interface sd_spi_miso conduit end
set_interface_property sd_spi_miso EXPORT_OF sd_spi_miso.external_connection
add_interface sd_spi_mosi conduit end
set_interface_property sd_spi_mosi EXPORT_OF sd_spi_mosi.external_connection
add_interface spi_master_to_maxv conduit end
set_interface_property spi_master_to_maxv EXPORT_OF spi_master_to_maxv.external
add_interface spi_master_to_maxv_irq interrupt sender
set_interface_property spi_master_to_maxv_irq EXPORT_OF spi_master_to_maxv.irq
add_interface uart_0_external_connection conduit end
set_interface_property uart_0_external_connection EXPORT_OF uart_0.external_connection
add_interface uart_0_irq interrupt sender
set_interface_property uart_0_irq EXPORT_OF uart_0.irq
add_interface uart_10_external_connection conduit end
set_interface_property uart_10_external_connection EXPORT_OF uart_10.external_connection
add_interface uart_10_irq interrupt sender
set_interface_property uart_10_irq EXPORT_OF uart_10.irq
add_interface uart_11_external_connection conduit end
set_interface_property uart_11_external_connection EXPORT_OF uart_11.external_connection
add_interface uart_11_irq interrupt sender
set_interface_property uart_11_irq EXPORT_OF uart_11.irq
add_interface uart_12_external_connection conduit end
set_interface_property uart_12_external_connection EXPORT_OF uart_12.external_connection
add_interface uart_12_irq interrupt sender
set_interface_property uart_12_irq EXPORT_OF uart_12.irq
add_interface uart_13_external_connection conduit end
set_interface_property uart_13_external_connection EXPORT_OF uart_13.external_connection
add_interface uart_13_irq interrupt sender
set_interface_property uart_13_irq EXPORT_OF uart_13.irq
add_interface uart_1_external_connection conduit end
set_interface_property uart_1_external_connection EXPORT_OF uart_1.external_connection
add_interface uart_1_irq interrupt sender
set_interface_property uart_1_irq EXPORT_OF uart_1.irq
add_interface uart_2_external_connection conduit end
set_interface_property uart_2_external_connection EXPORT_OF uart_2.external_connection
add_interface uart_2_irq interrupt sender
set_interface_property uart_2_irq EXPORT_OF uart_2.irq
add_interface uart_3_external_connection conduit end
set_interface_property uart_3_external_connection EXPORT_OF uart_3.external_connection
add_interface uart_3_irq interrupt sender
set_interface_property uart_3_irq EXPORT_OF uart_3.irq
add_interface uart_4_external_connection conduit end
set_interface_property uart_4_external_connection EXPORT_OF uart_4.external_connection
add_interface uart_4_irq interrupt sender
set_interface_property uart_4_irq EXPORT_OF uart_4.irq
add_interface uart_5_external_connection conduit end
set_interface_property uart_5_external_connection EXPORT_OF uart_5.external_connection
add_interface uart_5_irq interrupt sender
set_interface_property uart_5_irq EXPORT_OF uart_5.irq
add_interface uart_6_external_connection conduit end
set_interface_property uart_6_external_connection EXPORT_OF uart_6.external_connection
add_interface uart_6_irq interrupt sender
set_interface_property uart_6_irq EXPORT_OF uart_6.irq
add_interface uart_7_external_connection conduit end
set_interface_property uart_7_external_connection EXPORT_OF uart_7.external_connection
add_interface uart_7_irq interrupt sender
set_interface_property uart_7_irq EXPORT_OF uart_7.irq
add_interface uart_8_external_connection conduit end
set_interface_property uart_8_external_connection EXPORT_OF uart_8.external_connection
add_interface uart_8_irq interrupt sender
set_interface_property uart_8_irq EXPORT_OF uart_8.irq
add_interface uart_9_external_connection conduit end
set_interface_property uart_9_external_connection EXPORT_OF uart_9.external_connection
add_interface uart_9_irq interrupt sender
set_interface_property uart_9_irq EXPORT_OF uart_9.irq
add_interface uart_enabled_word conduit end
set_interface_property uart_enabled_word EXPORT_OF uart_enabled.external_connection
add_interface uart_internal_disable_external_connection conduit end
set_interface_property uart_internal_disable_external_connection EXPORT_OF uart_internal_disable.external_connection
add_interface uart_internal_enable_external_connection conduit end
set_interface_property uart_internal_enable_external_connection EXPORT_OF uart_internal_enable.external_connection
add_interface uart_is_regfile_external_connection conduit end
set_interface_property uart_is_regfile_external_connection EXPORT_OF uart_is_regfile.external_connection

set_interconnect_requirement {$system} qsys_mm.clockCrossingAdapter HANDSHAKE
set_interconnect_requirement {$system} qsys_mm.maxAdditionalLatency 3

save_system linnux_support_simplified.qsys
